# Altium schematic sheet ADC.SchDoc (part 3 of 3)
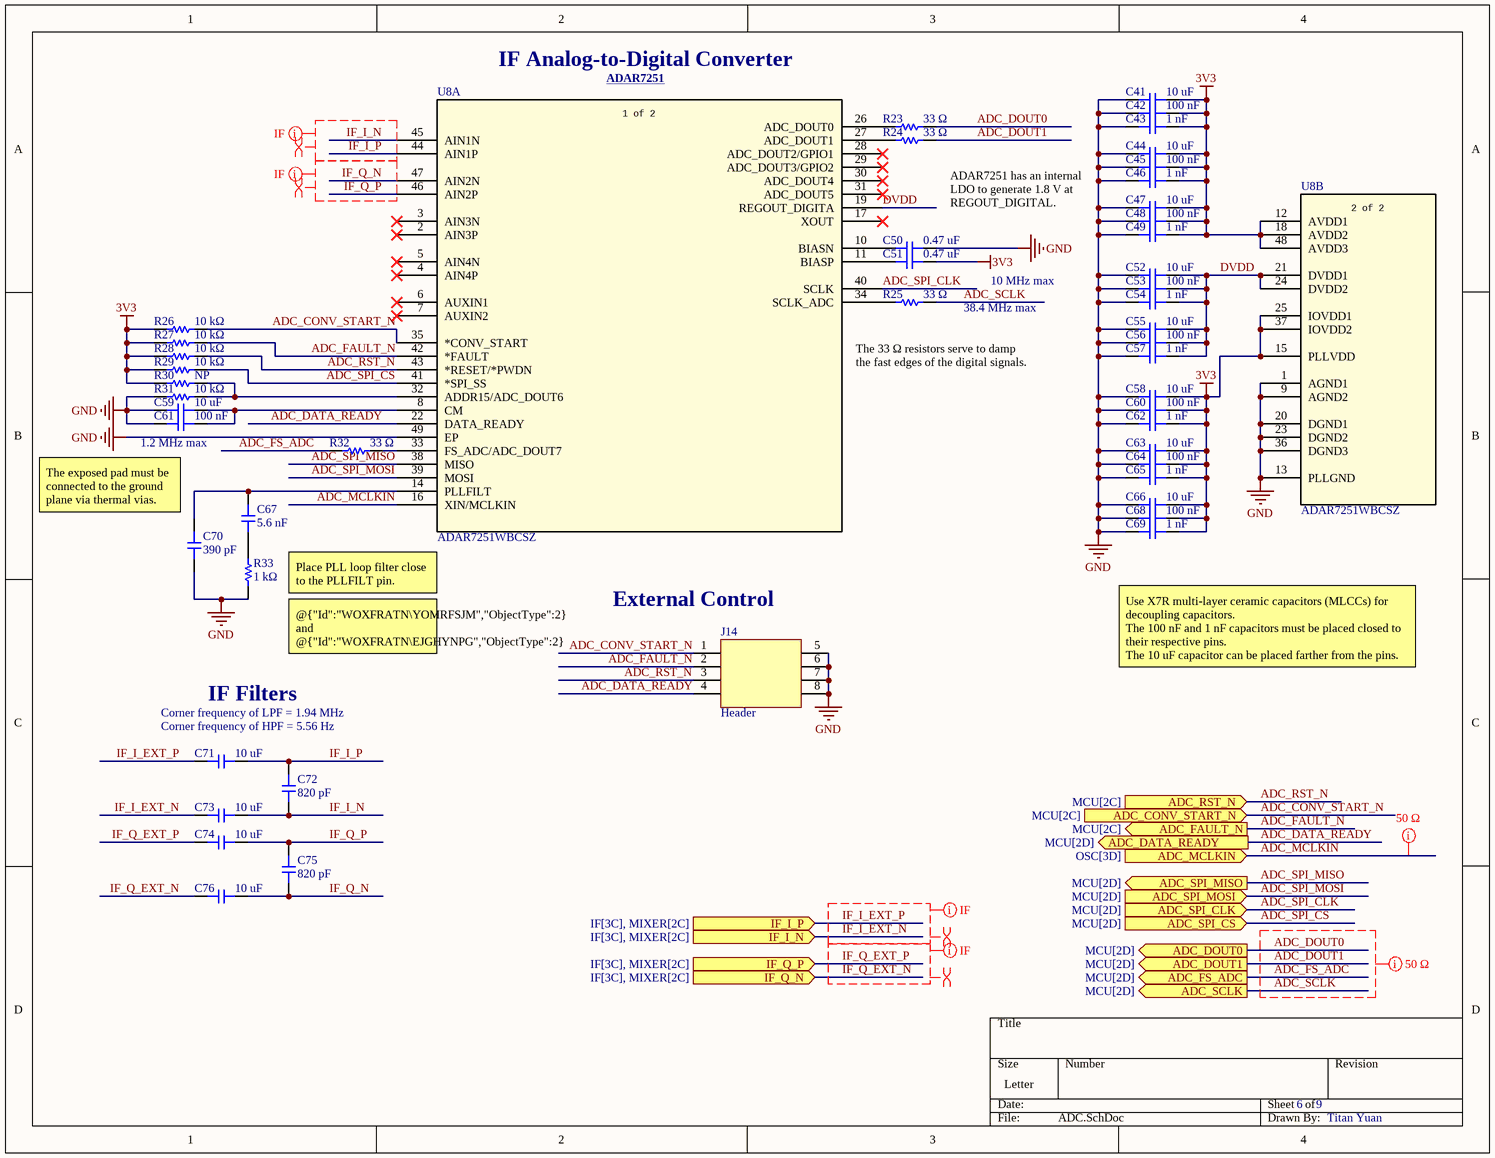
[diagram p2: ADC.SchDoc]

## Library data of the parts (continued)
R26-R29 R31 = RES: Res Thick Film 0402 10K Ohm 1% 0.063W(1/16W) ±100ppm/C Pad SMD T/R; Manufacturer: Yageo; Manufacturer Part Number: RC0402FR-0710KL; Power Dissipation: 62.5mW; Power Rating: 63mW; Value: 10kΩ; Temperature Coefficient: 100ppm/°C; Voltage Rating: 50V; Tolerance: 1%; Package Size: 0402; Supplier: DigiKey; Supplier Part Number: 311-10.0KLRCT-ND; RoHS: Compliant; Category: Chip SMD Resistors; Stock: 9059080; Pricing: 1=0.1, 10=0.012, 25=0.0092, 50=0.0062, 100=0.0056, 250=0.00472, 500=0.00328, 10000=0.00204, 20000=0.00153 (USD); Case/Package: 0402; Case Code (Imperial): 0402; Case Code (Metric): 0402; China RoHS: Non-Compliant; Composition: Thick Film; Country of Origin: Mainland China, Taiwan; Depth: 500µm; Export Control Classification Number (ECCN) Code: EAR99; Height: 350µm; Harmonized Tariff Schedule (HTS) Code: 8533.21.00.30; Introduction Date: 2004-10-04; Lead Free: Lead Free; Lead Pitch: 200µm; Length: 1mm; Lifecycle Status: Production; Max Operating Temperature: 155°C; Military Standard: Not; Min Operating Temperature: -55°C; Mounting Technology: Surface Mount; Pins: 2; Number of Terminals: 2; Number of Terminations: 2; Packaging: Tape & Reel; REACH SVHC: Yes; Schedule B: 8533210045, 8533210045|8533210045|8533210045|8533210045|8533210045|8533210045|8533210045|8533210045|8533210045|8533210045|8533210045|8533210045|8533210045|8533210045, 8533210045|8533210045|8533210045|8533210045|8533210045|8533210045|8533210045|8533210045|8533210045|8533210045|8533210045|8533210045|8533210045|8533210045|8533210045, 8533210045|8533210045|8533210045|8533210045|8533210045|8533210045|8533210045|8533210045|8533210045|8533210045|8533210045|8533210045|8533210045|8533210045|8533210045|8533210045; Termination: SMD/SMT; Voltage Rating (DC): 50V; Width: 500µm; Working Voltage: 50V; ComponentLink1URL: https://datasheet.octopart.com:443/RC0402FR-0710KL-Yageo-datasheet-175887523.pdf?src-supplier=Newark; ComponentLink1Description: https://datasheet.octopart.com:443/RC0402FR-0710KL-Yageo-datasheet-175887523.pdf?src-supplier=Newark; ComponentLink2URL: https://datasheet.octopart.com:443/RC0402FR-0710KL-Yageo-datasheet-12531192.pdf?src-supplier=Newark; ComponentLink2Description: https://datasheet.octopart.com:443/RC0402FR-0710KL-Yageo-datasheet-12531192.pdf?src-supplier=Newark; ComponentLink3URL: https://datasheet.octopart.com:443/RC0402FR-0710KL-Yageo-datasheet-8324527.pdf?src-supplier=Newark; ComponentLink3Description: https://datasheet.octopart.com:443/RC0402FR-0710KL-Yageo-datasheet-8324527.pdf?src-supplier=Newark; ComponentLink4URL: https://datasheet.octopart.com:443/RC0402FR-0710KL-Yageo-datasheet-10408619.pdf?src-supplier=element14+APAC; ComponentLink4Description: https://datasheet.octopart.com:443/RC0402FR-0710KL-Yageo-datasheet-10408619.pdf?src-supplier=element14+APAC; ComponentLink5URL: https://datasheet.octopart.com:443/RC0402FR-0710KL-Yageo-datasheet-62067350.pdf?src-supplier=element14+APAC; ComponentLink5Description: https://datasheet.octopart.com:443/RC0402FR-0710KL-Yageo-datasheet-62067350.pdf?src-supplier=element14+APAC; ComponentLink6URL: https://datasheet.octopart.com:443/RC0402FR-0710KL-Yageo-datasheet-21426659.pdf?src-supplier=element14+APAC; ComponentLink6Description: https://datasheet.octopart.com:443/RC0402FR-0710KL-Yageo-datasheet-21426659.pdf?src-supplier=element14+APAC; ComponentLink7URL: https://datasheet.octopart.com:443/RC0402FR-0710KL-Yageo-datasheet-164759695.pdf?src-supplier=Upverter; ComponentLink7Description: https://datasheet.octopart.com:443/RC0402FR-0710KL-Yageo-datasheet-164759695.pdf?src-supplier=Upverter; ComponentLink8URL: https://datasheet.octopart.com:443/RC0402FR-0710KL-Yageo-datasheet-103092701.pdf?src-supplier=Upverter; ComponentLink8Description: https://datasheet.octopart.com:443/RC0402FR-0710KL-Yageo-datasheet-103092701.pdf?src-supplier=Upverter; ComponentLink9URL: https://sigma.octopart.com:443/138820526/technical_drawing/Yageo-RC0402FR-0710KL.pdf?src-supplier=Upverter; ComponentLink9Description: https://sigma.octopart.com:443/138820526/technical_drawing/Yageo-RC0402FR-0710KL.pdf?src-supplier=Upverter; ComponentLink10URL: https://datasheet.octopart.com:443/RC0402FR-0710KL-Yageo-datasheet-98239111.pdf?src-supplier=Upverter; ComponentLink10Description: https://datasheet.octopart.com:443/RC0402FR-0710KL-Yageo-datasheet-98239111.pdf?src-supplier=Upverter; ComponentLink11URL: https://datasheet.octopart.com:443/RC0402FR-0710KL-Yageo-datasheet-68298067.pdf?src-supplier=Upverter; ComponentLink11Description: https://datasheet.octopart.com:443/RC0402FR-0710KL-Yageo-datasheet-68298067.pdf?src-supplier=Upverter; ComponentLink12URL: https://datasheet.octopart.com:443/RC0402FR-0710KL-Yageo-datasheet-68297981.pdf?src-supplier=Upverter; ComponentLink12Description: https://datasheet.octopart.com:443/RC0402FR-0710KL-Yageo-datasheet-68297981.pdf?src-supplier=Upverter; ComponentLink13URL: https://datasheet.octopart.com:443/RC0402FR-0710KL-Yageo-datasheet-141435361.pdf?src-supplier=Upverter; ComponentLink13Description: https://datasheet.octopart.com:443/RC0402FR-0710KL-Yageo-datasheet-141435361.pdf?src-supplier=Upverter; ComponentLink14URL: https://datasheet.octopart.com:443/RC0402FR-0710KL-Yageo-datasheet-12509768.pdf?src-supplier=Upverter; ComponentLink14Description: https://datasheet.octopart.com:443/RC0402FR-0710KL-Yageo-datasheet-12509768.pdf?src-supplier=Upverter; ComponentLink15URL: https://datasheet.octopart.com:443/RC0402FR-0710KL-Yageo-Group-datasheet-190305687.pdf?src-supplier=Future+Electronics; ComponentLink15Description: https://datasheet.octopart.com:443/RC0402FR-0710KL-Yageo-Group-datasheet-190305687.pdf?src-supplier=Future+Electronics; ComponentLink16URL: https://datasheet.octopart.com:443/RC0402FR-0710KL-Yageo-datasheet-137700087.pdf?src-supplier=Future+Electronics; ComponentLink16Description: https://datasheet.octopart.com:443/RC0402FR-0710KL-Yageo-datasheet-137700087.pdf?src-supplier=Future+Electronics; ComponentLink17URL: https://datasheet.octopart.com:443/RC0402FR-0710KL-Yageo-datasheet-8324255.pdf?src-supplier=Future+Electronics; ComponentLink17Description: https://datasheet.octopart.com:443/RC0402FR-0710KL-Yageo-datasheet-8324255.pdf?src-supplier=Future+Electronics; ComponentLink18URL: https://datasheet.octopart.com:443/RC0402FR-0710KL-Yageo-datasheet-8329306.pdf?src-supplier=element14; ComponentLink18Description: https://datasheet.octopart.com:443/RC0402FR-0710KL-Yageo-datasheet-8329306.pdf?src-supplier=element14; ComponentLink19URL: https://datasheet.octopart.com:443/RC0402FR-0710KL-Yageo-datasheet-505231.pdf?src-supplier=element14; ComponentLink19Description: https://datasheet.octopart.com:443/RC0402FR-0710KL-Yageo-datasheet-505231.pdf?src-supplier=element14; ComponentLink20URL: https://datasheet.octopart.com:443/RC0402FR-0710KL-Yageo-datasheet-175423674.pdf?src-supplier=SOS+electronic; ComponentLink20Description: https://datasheet.octopart.com:443/RC0402FR-0710KL-Yageo-datasheet-175423674.pdf?src-supplier=SOS+electronic; ComponentLink21URL: https://datasheet.octopart.com:443/RC0402FR-0710KL-Yageo-datasheet-79472498.pdf?src-supplier=Megastar; ComponentLink21Description: https://datasheet.octopart.com:443/RC0402FR-0710KL-Yageo-datasheet-79472498.pdf?src-supplier=Megastar; ComponentLink22URL: https://datasheet.octopart.com/RC0402FR-0710KL-Yageo-datasheet-73766026.pdf; ComponentLink22Description: https://datasheet.octopart.com/RC0402FR-0710KL-Yageo-datasheet-73766026.pdf; ComponentLink23URL: http://sigma.octopart.com:80/conflict_mineral_statement/Yageo-company-3.pdf?src-supplier=Compliance+Statements; ComponentLink23Description: http://sigma.octopart.com:80/conflict_mineral_statement/Yageo-company-3.pdf?src-supplier=Compliance+Statements; ComponentLink24URL: http://sigma.octopart.com:80/rohs_statement/Yageo-company-2.pdf?src-supplier=Compliance+Statements; ComponentLink24Description: http://sigma.octopart.com:80/rohs_statement/Yageo-company-2.pdf?src-supplier=Compliance+Statements
R30 = RES: Resistor SMD Generic; Manufacturer: *; Manufacturer Part Number: *; Tolerance: *; Voltage Rating: *; Package Size: 0402
R33 = RES: Res Thin Film 0402 1K Ohm 0.1% 0.063W(1/16W) ±25ppm/C Pad SMD T/R; Manufacturer: Yageo; Manufacturer Part Number: RT0402BRD071KL; Max Power Dissipation: 63mW; Power Dissipation: 62.5mW; Value: 1kΩ; Temperature Coefficient: 25ppm/°C; Voltage Rating: 50V; Tolerance: 0.1%; Package Size: 0402; Supplier: DigiKey; Supplier Part Number: YAG1386CT-ND; RoHS: Compliant; Category: Chip SMD Resistors; Stock: 241072; Pricing: 1=0.1, 10=0.061, 25=0.0592, 50=0.0572, 100=0.0556, 250=0.05408, 500=0.04692, 1000=0.04567 (USD); Case/Package: 0402; Case Code (Imperial): 0402; China RoHS: Non-Compliant; Composition: Thin Film; Depth: 500µm; Features: Moisture Resistant; Height: 300µm; Lead Free: Lead Free; Length: 1mm; Lifecycle Status: Production; Max Operating Temperature: 155°C; Military Standard: Not; Min Operating Temperature: -55°C; Mounting Technology: Surface Mount; Number of Terminals: 2; Number of Terminations: 2; Power Rating: 63mW; REACH SVHC: Yes; Schedule B: 8533210045, 8533210045|8533210045|8533210045|8533210045|8533210045|8533210045|8533210045|8533210045|8533210045|8533210045|8533210045|8533210045|8533210045, 8533210045|8533210045|8533210045|8533210045|8533210045|8533210045|8533210045|8533210045|8533210045|8533210045|8533210045|8533210045|8533210045|8533210045, 8533210045|8533210045|8533210045|8533210045|8533210045|8533210045|8533210045|8533210045|8533210045|8533210045|8533210045|8533210045|8533210045|8533210045|8533210045; Termination: SMD/SMT; Voltage Rating (DC): 50V; Weight: 652.039032µg; Width: 500µm; Working Voltage: 50V; ComponentLink1URL: https://datasheet.octopart.com:443/RT0402BRD071KL-Yageo-datasheet-176402239.pdf?src-supplier=Future+Electronics; ComponentLink1Description: https://datasheet.octopart.com:443/RT0402BRD071KL-Yageo-datasheet-176402239.pdf?src-supplier=Future+Electronics; ComponentLink2URL: https://datasheet.octopart.com:443/RT0402BRD071KL-Yageo-datasheet-169971040.pdf?src-supplier=Future+Electronics; ComponentLink2Description: https://datasheet.octopart.com:443/RT0402BRD071KL-Yageo-datasheet-169971040.pdf?src-supplier=Future+Electronics; ComponentLink3URL: https://datasheet.octopart.com:443/RT0402BRD071KL-Yageo-datasheet-166250672.pdf?src-supplier=Future+Electronics; ComponentLink3Description: https://datasheet.octopart.com:443/RT0402BRD071KL-Yageo-datasheet-166250672.pdf?src-supplier=Future+Electronics; ComponentLink4URL: https://datasheet.octopart.com:443/RT0402BRD071KL-Yageo-datasheet-136673517.pdf?src-supplier=Future+Electronics; ComponentLink4Description: https://datasheet.octopart.com:443/RT0402BRD071KL-Yageo-datasheet-136673517.pdf?src-supplier=Future+Electronics; ComponentLink5URL: https://datasheet.octopart.com:443/RT0402BRD071KL-Yageo-datasheet-137700930.pdf?src-supplier=Future+Electronics; ComponentLink5Description: https://datasheet.octopart.com:443/RT0402BRD071KL-Yageo-datasheet-137700930.pdf?src-supplier=Future+Electronics; ComponentLink6URL: https://datasheet.octopart.com:443/RT0402BRD071KL-Yageo-datasheet-96443642.pdf?src-supplier=Future+Electronics; ComponentLink6Description: https://datasheet.octopart.com:443/RT0402BRD071KL-Yageo-datasheet-96443642.pdf?src-supplier=Future+Electronics; ComponentLink7URL: https://datasheet.octopart.com:443/RT0402BRD071KL-Yageo-datasheet-12594463.pdf?src-supplier=Future+Electronics; ComponentLink7Description: https://datasheet.octopart.com:443/RT0402BRD071KL-Yageo-datasheet-12594463.pdf?src-supplier=Future+Electronics; ComponentLink8URL: https://datasheet.octopart.com:443/RT0402BRD071KL-Yageo-datasheet-8324589.pdf?src-supplier=Future+Electronics; ComponentLink8Description: https://datasheet.octopart.com:443/RT0402BRD071KL-Yageo-datasheet-8324589.pdf?src-supplier=Future+Electronics; ComponentLink9URL: https://datasheet.octopart.com:443/RT0402BRD071KL-Yageo-datasheet-34924148.pdf?src-supplier=Future+Electronics; ComponentLink9Description: https://datasheet.octopart.com:443/RT0402BRD071KL-Yageo-datasheet-34924148.pdf?src-supplier=Future+Electronics; ComponentLink10URL: https://datasheet.octopart.com:443/RT0402BRD071KL-Yageo-datasheet-141265893.pdf?src-supplier=ODG+(Origin+Data+Global); ComponentLink10Description: https://datasheet.octopart.com:443/RT0402BRD071KL-Yageo-datasheet-141265893.pdf?src-supplier=ODG+(Origin+Data+Global); ComponentLink11URL: https://sigma.octopart.com:443/138820526/technical_drawing/Yageo-RT0402BRD071KL.pdf?src-supplier=Upverter; ComponentLink11Description: https://sigma.octopart.com:443/138820526/technical_drawing/Yageo-RT0402BRD071KL.pdf?src-supplier=Upverter; ComponentLink12URL: https://datasheet.octopart.com:443/RT0402BRD071KL-Yageo-datasheet-10915759.pdf?src-supplier=TME; ComponentLink12Description: https://datasheet.octopart.com:443/RT0402BRD071KL-Yageo-datasheet-10915759.pdf?src-supplier=TME; ComponentLink13URL: https://datasheet.octopart.com:443/RT0402BRD071KL-Yageo-datasheet-164439670.pdf?src-supplier=Newark; ComponentLink13Description: https://datasheet.octopart.com:443/RT0402BRD071KL-Yageo-datasheet-164439670.pdf?src-supplier=Newark; ComponentLink14URL: https://datasheet.octopart.com:443/RT0402BRD071KL-Yageo-datasheet-120102479.pdf?src-supplier=Megastar; ComponentLink14Description: https://datasheet.octopart.com:443/RT0402BRD071KL-Yageo-datasheet-120102479.pdf?src-supplier=Megastar; ComponentLink15URL: https://datasheet.octopart.com/RT0402BRD071KL-Yageo-datasheet-86813807.pdf; ComponentLink15Description: https://datasheet.octopart.com/RT0402BRD071KL-Yageo-datasheet-86813807.pdf; ComponentLink16URL: http://sigma.octopart.com:80/conflict_mineral_statement/Yageo-company-3.pdf?src-supplier=Compliance+Statements; ComponentLink16Description: http://sigma.octopart.com:80/conflict_mineral_statement/Yageo-company-3.pdf?src-supplier=Compliance+Statements; ComponentLink17URL: http://sigma.octopart.com:80/rohs_statement/Yageo-company-2.pdf?src-supplier=Compliance+Statements; ComponentLink17Description: http://sigma.octopart.com:80/rohs_statement/Yageo-company-2.pdf?src-supplier=Compliance+Statements
U8 = ADAR7251WBCSZ: 4-Channel Quad ADC Delta-Sigma 1.8Msps 16-bit Parallel/Serial Automotive 48-Pin LFCSP EP T/R; Manufacturer_Name: Analog Devices Inc; Manufacturer: Analog Devices; Manufacturer Lifecycle Status: NOT RECOMMENDED FOR NEW DESIGN; Interface: Parallel, SPI; Number of A/D Converters: 4; Number of Bits: 16; Copyright: Copyright (C) 2025 Ultra Librarian. All rights reserved.; Manufacturer_Part_Number: ADAR7251WBCSZ; Datasheet: https://www.analog.com/media/en/technical-documentation/data-sheets/ADAR7251.pdf; RefDes: RefDes; Type: Type; Supplier: Arrow Electronics; Supplier Part Number: ADAR7251WBCSZ-RL; Manufacturer Part Number: ADAR7251WBCSZ; RoHS: Compliant; Category: Analog to Digital Converters (ADCs); Stock: 1518; Pricing: 1=17.58, 10=17.31, 25=17.04, 100=16.77, 250=16.49, 500=16.22, 1000=15.95 (USD); Case/Package: QFN; Lead Free: Contains Lead; Lifecycle Status: Production; Max Operating Temperature: 125°C; Min Operating Temperature: -40°C; Number of Inputs: 4; Pins: 48; Packaging: Tape and Reel; Sampling Rate: 1.8Msps; Schedule B: 8542390000, 8542390000|8542390000|8542390000|8542390000|8542390000; ComponentLink1URL: https://datasheet.octopart.com:443/ADAR7251WBCSZ-RL-Analog-Devices-datasheet-37108182.pdf?src-supplier=Upverter; ComponentLink1Description: https://datasheet.octopart.com:443/ADAR7251WBCSZ-RL-Analog-Devices-datasheet-37108182.pdf?src-supplier=Upverter; ComponentLink2URL: https://octopart.com:443/opatz8j6/c1?t=CQmgxgzF3TS1DSQPN3cDiG0EYWfU1hgwPhmTexDVZLnR1yZQOElAuyPbML9mgDJkPVxpVD3gYcoY03UYbhc9VkRaca9L0HaHtXuMsNFf2r7kStaMExwc3y8Qy8XWZPSfY4husBBcSXxc0bo4wKO_VIhVldzI7K2uCW-t-YqmoWcieXASzNGiaG2Bub2XzkGmAw1BAALsiXjrYth_GIRcMxKMuexNTsFZxWzEW-RJC1yoCn1dh43rOqnwSWnkt7ugxSJEi6_2jxpsji6pZNy2X20IdN1ynU6w9VyR75RcBgi_pduDOVpUW0AX&src-supplier=Analog+Devices; ComponentLink2Description: https://octopart.com:443/opatz8j6/c1?t=CQmgxgzF3TS1DSQPN3cDiG0EYWfU1hgwPhmTexDVZLnR1yZQOElAuyPbML9mgDJkPVxpVD3gYcoY03UYbhc9VkRaca9L0HaHtXuMsNFf2r7kStaMExwc3y8Qy8XWZPSfY4husBBcSXxc0bo4wKO_VIhVldzI7K2uCW-t-YqmoWcieXASzNGiaG2Bub2XzkGmAw1BAALsiXjrYth_GIRcMxKMuexNTsFZxWzEW-RJC1yoCn1dh43rOqnwSWnkt7ugxSJEi6_2jxpsji6pZNy2X20IdN1ynU6w9VyR75RcBgi_pduDOVpUW0AX&src-supplier=Analog+Devices; ComponentLink3URL: https://datasheet.octopart.com:443/ADAR7251WBCSZ-RL-Analog-Devices-datasheet-79793795.pdf?src-supplier=SHENGYU+ELECTRONICS; ComponentLink3Description: https://datasheet.octopart.com:443/ADAR7251WBCSZ-RL-Analog-Devices-datasheet-79793795.pdf?src-supplier=SHENGYU+ELECTRONICS; ComponentLink4URL: http://sigma.octopart.com:80/conflict_mineral_statement/Analog-Devices-company-33.pdf?src-supplier=Compliance+Statements; ComponentLink4Description: http://sigma.octopart.com:80/conflict_mineral_statement/Analog-Devices-company-33.pdf?src-supplier=Compliance+Statements; ComponentLink5URL: https://octopart.com:443/opatz8j6/c1?t=QP5QRZ8fNHIlvGQJKDbEcehpvKXZdY016AwOjUrM50DrZC_R-f1Pg-EuaWOyKDZH9OBd7dWivR_i3nk3Xo26w2sGsBnPhkVsSzYG81pmL3ea60Kmr0a8UUo0ZL-YYfNFq7KTASlEeG1WvdeIoSBT5hBvzH64l4FkDtEivSQbImbmNw6Y08ax0d8WdYuFh5ejQZzFivnYTWpTOoJzNsRVn8w6iClEFe_CmzJzioseeE7rWrtas6d9CbFF5KEvx48S6-N7O0YoKKepe4BUbaANJTYqghQhF1t7el8qVACiHhz-ck11jaWvVU3U&src-supplier=Compliance+Statements; ComponentLink5Description: https://octopart.com:443/opatz8j6/c1?t=QP5QRZ8fNHIlvGQJKDbEcehpvKXZdY016AwOjUrM50DrZC_R-f1Pg-EuaWOyKDZH9OBd7dWivR_i3nk3Xo26w2sGsBnPhkVsSzYG81pmL3ea60Kmr0a8UUo0ZL-YYfNFq7KTASlEeG1WvdeIoSBT5hBvzH64l4FkDtEivSQbImbmNw6Y08ax0d8WdYuFh5ejQZzFivnYTWpTOoJzNsRVn8w6iClEFe_CmzJzioseeE7rWrtas6d9CbFF5KEvx48S6-N7O0YoKKepe4BUbaANJTYqghQhF1t7el8qVACiHhz-ck11jaWvVU3U&src-supplier=Compliance+Statements